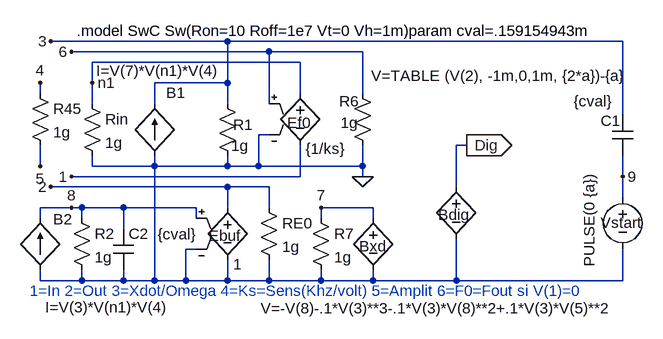
[diagram p0: schematic vconew.asc]
vconew.asc, the LTspice schematic file:
Version 4
SHEET 1 1184 680
WIRE -240 208 -240 192
WIRE -240 320 -240 288
WIRE -240 400 -240 384
WIRE -240 496 -240 480
WIRE -192 384 -240 384
WIRE -176 384 -192 384
WIRE -176 400 -176 384
WIRE -176 496 -240 496
WIRE -176 496 -176 480
WIRE -160 192 -160 160
WIRE -160 224 -160 192
WIRE -160 320 -160 304
WIRE -112 384 -176 384
WIRE -112 416 -112 384
WIRE -112 496 -176 496
WIRE -112 496 -112 480
WIRE -64 224 -64 192
WIRE -64 320 -160 320
WIRE -64 320 -64 304
WIRE -64 496 -112 496
WIRE -64 496 -64 320
WIRE -16 496 -64 496
WIRE -16 496 -16 448
WIRE 0 384 -112 384
WIRE 0 400 0 384
WIRE 0 448 -16 448
WIRE 48 128 -224 128
WIRE 48 192 -64 192
WIRE 48 192 48 128
WIRE 48 224 48 192
WIRE 48 320 -64 320
WIRE 48 320 48 304
WIRE 48 352 -224 352
WIRE 48 384 48 352
WIRE 48 496 -16 496
WIRE 48 496 48 464
WIRE 96 320 48 320
WIRE 96 320 96 272
WIRE 112 144 -192 144
WIRE 112 224 112 144
WIRE 112 272 96 272
WIRE 112 352 48 352
WIRE 112 384 112 352
WIRE 112 496 48 496
WIRE 112 496 112 464
WIRE 160 160 -160 160
WIRE 160 208 160 160
WIRE 160 336 -192 336
WIRE 160 336 160 288
WIRE 192 400 192 384
WIRE 192 496 112 496
WIRE 192 496 192 480
WIRE 256 144 112 144
WIRE 256 208 256 144
WIRE 256 320 96 320
WIRE 256 320 256 288
WIRE 256 336 256 320
WIRE 272 384 192 384
WIRE 272 400 272 384
WIRE 272 496 192 496
WIRE 272 496 272 480
WIRE 400 352 400 288
WIRE 400 496 272 496
WIRE 400 496 400 432
WIRE 416 288 400 288
WIRE 656 128 48 128
WIRE 656 240 656 128
WIRE 656 336 656 304
WIRE 656 368 656 336
WIRE 656 496 400 496
WIRE 656 496 656 448
FLAG 256 336 0
FLAG -192 336 1
FLAG -224 128 3
FLAG -192 384 8
FLAG 192 384 7
FLAG -224 352 2
FLAG 656 336 9
FLAG -240 192 4
FLAG -240 320 5
FLAG -192 144 6
FLAG -160 192 n1
FLAG 416 288 Dig
IOPIN 416 288 Out
SYMBOL res -176 208 R0
SYMATTR InstName Rin
SYMATTR Value 1g
SYMBOL res 96 368 R0
SYMATTR InstName RE0
SYMATTR Value 1g
SYMBOL bi -64 304 R180
WINDOW 0 -47 97 Left 0
WINDOW 3 -100 131 Left 0
SYMATTR InstName B1
SYMATTR Value I=V(7)*V(n1)*V(4)
SYMBOL res 32 208 R0
WINDOW 0 25 48 Left 0
WINDOW 3 22 81 Left 0
SYMATTR InstName R1
SYMATTR Value 1g
SYMBOL bi -240 480 R180
WINDOW 0 -49 78 Left 0
WINDOW 3 -197 -57 Left 0
SYMATTR InstName B2
SYMATTR Value I=V(3)*V(n1)*V(4)
SYMBOL res -192 384 R0
SYMATTR InstName R2
SYMATTR Value 1g
SYMBOL cap -128 416 R0
WINDOW 3 69 9 Left 0
SYMATTR Value {cval}
SYMATTR InstName C2
SYMBOL bv 272 384 R0
WINDOW 0 -21 59 Left 0
WINDOW 3 -173 155 Left 0
SYMATTR InstName Bxd
SYMATTR Value V=-V(8)-.1*V(3)**3-.1*V(3)*V(8)**2+.1*V(3)*V(5)**2
SYMBOL res 176 384 R0
SYMATTR InstName R7
SYMATTR Value 1g
SYMBOL e 48 368 R0
WINDOW 0 -29 59 Left 0
WINDOW 3 9 103 Left 0
SYMATTR InstName Ebuf
SYMATTR Value 1
SYMBOL voltage 656 352 R0
WINDOW 0 -34 55 Left 0
WINDOW 3 -51 -22 VRight 0
WINDOW 123 0 0 Left 0
WINDOW 39 0 0 Left 0
SYMATTR InstName Vstart
SYMATTR Value PULSE(0 {a})
SYMBOL cap 640 240 R0
WINDOW 0 -18 10 Left 0
WINDOW 3 0 -20 Right 0
SYMATTR InstName C1
SYMATTR Value {cval}
SYMBOL res -256 192 R0
SYMATTR InstName R45
SYMATTR Value 1g
SYMBOL res 240 192 R0
WINDOW 0 -20 28 Left 0
WINDOW 3 -18 61 Left 0
SYMATTR InstName R6
SYMATTR Value 1g
SYMBOL e 160 192 R0
WINDOW 0 -20 61 Left 0
WINDOW 3 8 101 Left 0
SYMATTR InstName Ef0
SYMATTR Value {1/ks}
SYMBOL bv 400 336 R0
WINDOW 0 -28 59 Left 0
WINDOW 3 -131 -155 Left 0
SYMATTR InstName Bdig
SYMATTR Value V=TABLE (V(2), -1m,0,1m, {2*a})-{a}
TEXT -256 512 Left 0 ;1=In 2=Out 3=Xdot/Omega 4=Ks=Sens(Khz/volt) 5=Amplit 6=F0=Fout si V(1)=0
TEXT 320 112 Left 0 !.param cval=.159154943m
TEXT -184 112 Left 0 !.model SwC Sw(Ron=10 Roff=1e7 Vt=0 Vh=1m)

The netlist it stands for:
* vconew.asc
Rin n1 0 1g
RE0 2 0 1g
B1 0 3 I=V(7)*V(n1)*V(4)
R1 3 0 1g
B2 0 8 I=V(3)*V(n1)*V(4)
R2 8 0 1g
C2 8 0 {cval}
Bxd 7 0 V=-V(8)-.1*V(3)**3-.1*V(3)*V(8)**2+.1*V(3)*V(5)**2
R7 7 0 1g
Ebuf 2 0 8 0 1
Vstart 9 0 PULSE(0 {a})
C1 3 9 {cval}
R45 4 5 1g
R6 6 0 1g
Ef0 n1 1 6 0 {1/ks}
Bdig Dig 0 V=TABLE (V(2), -1m,0,1m, {2*a})-{a}
* 1=In 2=Out 3=Xdot/Omega 4=Ks=Sens(Khz/volt) 5=Amplit 6=F0=Fout si V(1)=0
.param cval=.159154943m
.model SwC Sw(Ron=10 Roff=1e7 Vt=0 Vh=1m)
.backanno
.end